# EAGLE design usbasp (EAGLE 6.4)
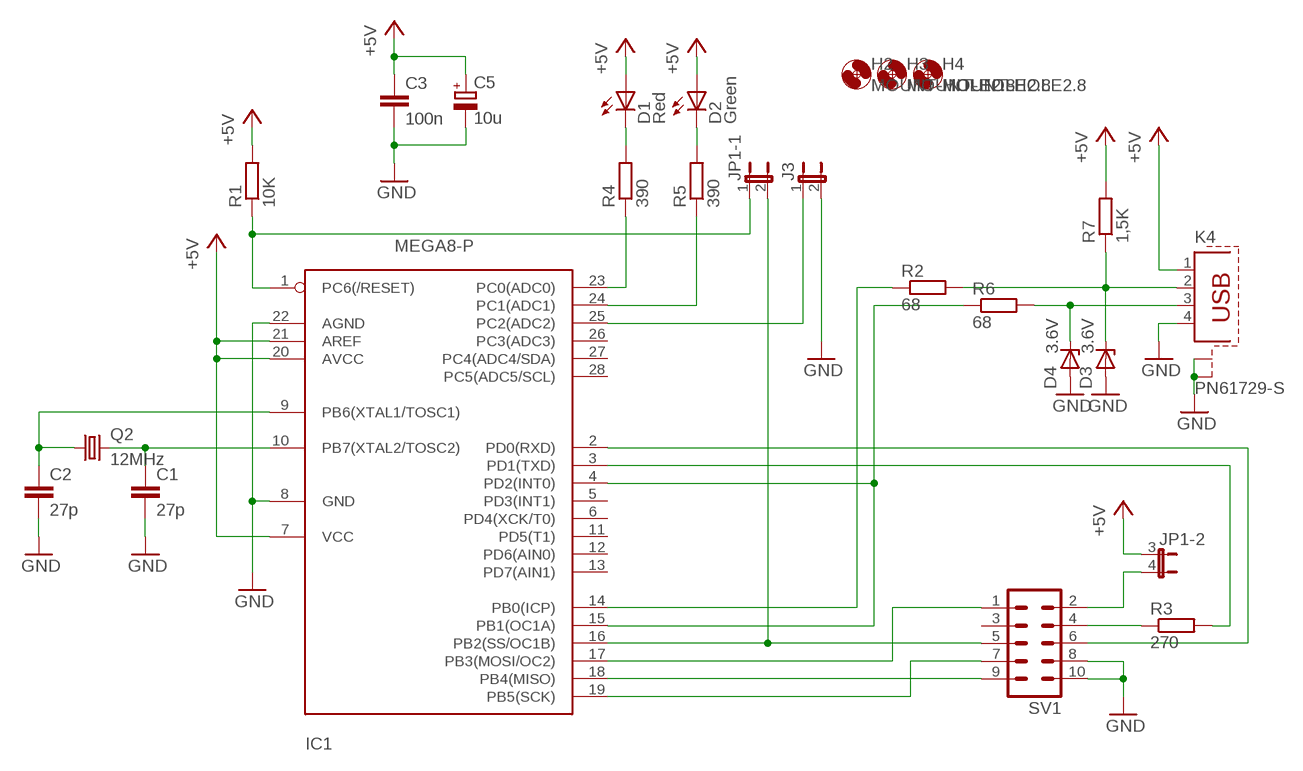
[diagram p0: schematic, sheet 1]

## Parts
C1  27p  C-EU025-024X044  [C025-024X044]
C2  27p  C-EU025-024X044  [C025-024X044]
C3  100n  C5/3  [C5B3]
C5  10u  CPOL-EUE2.5-5  [E2,5-5]
D1  Red  LED5MM  [LED5MM]
D2  Green  LED5MM  [LED5MM]
D3  3.6V  ZENER-DIODEDO34-7  [DO34Z7]
D4  3.6V  ZENER-DIODEDO34-7  [DO34Z7]
H2  MOUNT-HOLE2.8  [2,8]
H3  MOUNT-HOLE2.8  [2,8]
H4  MOUNT-HOLE2.8  [2,8]
IC1  MEGA8-P  [DIL28-3]
J3  JP1E  [JP1]
JP1  JP2QE  [JP2Q]
K4  PN61729-S  [PN61729-S]
Q2  12MHz  CRYSTALHC49S  [HC49/S]
R1  10K  R-EU_0207/10  [0207/10]
R2  68  R-EU_0207/10  [0207/10]
R3  270  R-EU_0207/10  [0207/10]
R4  390  R-EU_0207/10  [0207/10]
R5  390  R-EU_0207/10  [0207/10]
R6  68  R-EU_0207/10  [0207/10]
R7  1,5K  R-EU_0207/10  [0207/10]
SV1  ML10LANG  [ML10_LANG]

## Nets
+5V: C3.1 C5.+ D1.A D2.A IC1.7(VCC) IC1.20(AVCC) IC1.21(AREF) JP1.3 K4.1 R1.2 R7.2
GND: C1.2 C2.2 C3.2 C5.- D3.A D4.A IC1.8(GND) IC1.22(AGND) J3.2 K4.4 K4.S1 K4.S2 SV1.8 SV1.10
N$1: D3.C K4.2 R2.2 R7.1
N$2: D4.C K4.3 R6.2
N$3: C1.1 IC1.10(PB7(XTAL2/TOSC2)) Q2.2
N$4: C2.1 IC1.9(PB6(XTAL1/TOSC1)) Q2.1
N$5: JP1.4 SV1.2
N$6: R3.1 SV1.4
N$7: IC1.3(PD1(TXD)) R3.2
N$8: IC1.2(PD0(RXD)) SV1.6
N$9: IC1.17(PB3(MOSI/OC2)) SV1.1
N$11: IC1.18(PB4(MISO)) SV1.9
N$12: IC1.16(PB2(SS/OC1B)) JP1.2 SV1.5
N$13: IC1.1(PC6(/RESET)) JP1.1 R1.1
N$14: IC1.14(PB0(ICP)) R2.1
N$15: IC1.25(PC2(ADC2)) J3.1
N$16: IC1.23(PC0(ADC0)) R4.1
N$17: IC1.24(PC1(ADC1)) R5.1
N$18: IC1.4(PD2(INT0)) IC1.15(PB1(OC1A)) R6.1
N$19: D1.K(C) R4.2
N$20: D2.K(C) R5.2
N$23: IC1.19(PB5(SCK)) SV1.7
Unconnected: IC1.5(PD3(INT1)) IC1.6(PD4(XCK/T0)) IC1.11(PD5(T1)) IC1.12(PD6(AIN0)) IC1.13(PD7(AIN1)) IC1.26(PC3(ADC3)) IC1.27(PC4(ADC4/SDA)) IC1.28(PC5(ADC5/SCL)) SV1.3

## Library data of the parts
C1 C2 = rcl:C-EU: CAPACITOR, European symbol
C3 = capacitor-wima:C: CAPACITOR naming: grid - package width
C5 = rcl:CPOL-EU: POLARIZED CAPACITOR, European symbol
D1 D2 = tim:LED: LED OSRAM: - CHIPLED LG R971, LG N971, LY N971, LG Q971, LY Q971, LO R971, LY R971 LH N974, LH R974 LS Q976, LO Q976, LY Q976 LO Q996 - Hyper CHIPLED LW Q18S LB Q993, LB Q99A, LB R99A - SideLED LS A670, LO A670, LY A670, LG A670, LP A670 LB A673, LV A673, LT A673, LW A673 LH A674 LY A675 LS A676, LA A676, LO A676, LY A676, LW A676 LS A679, LY A679, LG A679 - Hyper Micro SIDELED® LS Y876, LA Y876, LO Y876, LY Y876 LT Y87S - SmartLED LW L88C, LW L88S LB L89C, LB L89S, LG L890 LS L89K, LO L89K, LY L89K LS L896, LA L896, LO L896, LY L896 - TOPLED LS T670, LO T670, LY T670, LG T670, LP T670 LSG T670, LSP T670, LSY T670, LOP T670, LYG T670 LG T671, LOG T671, LSG T671 LB T673, LV T673, LT T673, LW T673 LH T674 LS T676, LA T676, LO T676, LY T676, LB T676, LH T676, LSB T676, LW T676 LB T67C, LV T67C, LT T67C, LS T67K, LO T67K, LY T67K, LW E67C LS E67B, LA E67B, LO E67B, LY E67B, LB E67C, LV E67C, LT E67C LW T67C LS T679, LY T679, LG T679 LS T770, LO T770, LY T770, LG T770, LP T770 LB T773, LV T773, LT T773, LW T773 LH T774 LS E675, LA E675, LY E675, LS T675 LS T776, LA T776, LO T776, LY T776, LB T776 LHGB T686 LT T68C, LB T68C - Hyper Mini TOPLED® LB M676 - Mini TOPLED Santana® LG M470 LS M47K, LO M47K, LY M47K Source: http://www.osram.convergy.de LUXEON: - LUMILED® LXK2-PW12-R00, LXK2-PW12-S00, LXK2-PW14-U00, LXK2-PW14-V00 LXK2-PM12-R00, LXK2-PM12-S00, LXK2-PM14-U00 LXK2-PE12-Q00, LXK2-PE12-R00, LXK2-PE12-S00, LXK2-PE14-T00, LXK2-PE14-U00 LXK2-PB12-K00, LXK2-PB12-L00, LXK2-PB12-M00, LXK2-PB14-N00, LXK2-PB14-P00, LXK2-PB14-Q00 LXK2-PR12-L00, LXK2-PR12-M00, LXK2-PR14-Q00, LXK2-PR14-R00 LXK2-PD12-Q00, LXK2-PD12-R00, LXK2-PD12-S00 LXK2-PH12-R00, LXK2-PH12-S00 LXK2-PL12-P00, LXK2-PL12-Q00, LXK2-PL12-R00 Source: www.luxeon.com KINGBRIGHT: KA-3528ASYC Source: www.kingbright.com
D3 D4 = diode:ZENER-DIODE: Z-Diode
H2-H4 = holes:MOUNT-HOLE: MOUNTING HOLE with drill center marker
IC1 = tim:MEGA8-P: MICROCONTROLLER 8 Kbytes FLASH 1 kbytes SRAM 512 bytes EEPROM USART 4-channel 10 bit ADC 2-channel 8 bit ADC
J3 = jumper:JP1E: JUMPER
JP1 = jumper:JP2QE: JUMPER
K4 = tim:PN61729-S: BERG USB connector; OC_FARNELL: unknown; OC_NEWARK: unknown
Q2 = tim:CRYSTAL: CRYSTAL; OC_FARNELL: 1667008; OC_NEWARK: unknown
R1-R7 = R:R-EU_: RESISTOR, European symbol
SV1 = conbig:ML10: HARTING

## Board
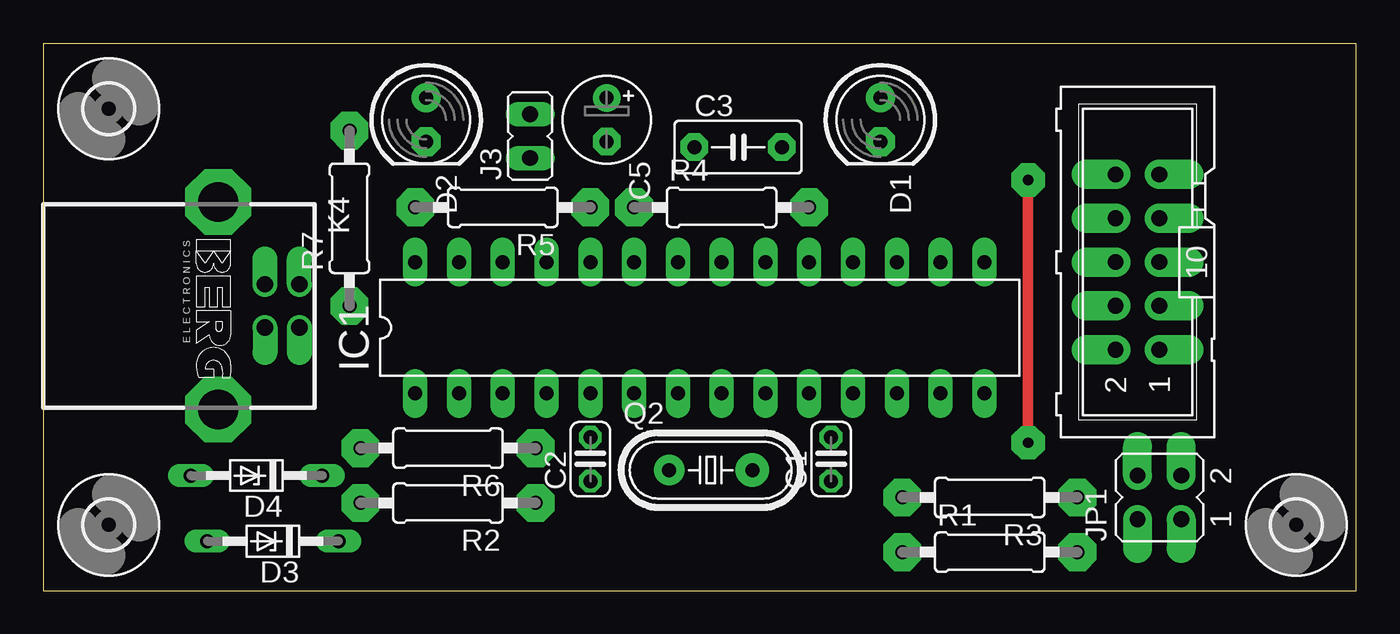
[diagram p1: board, top side]
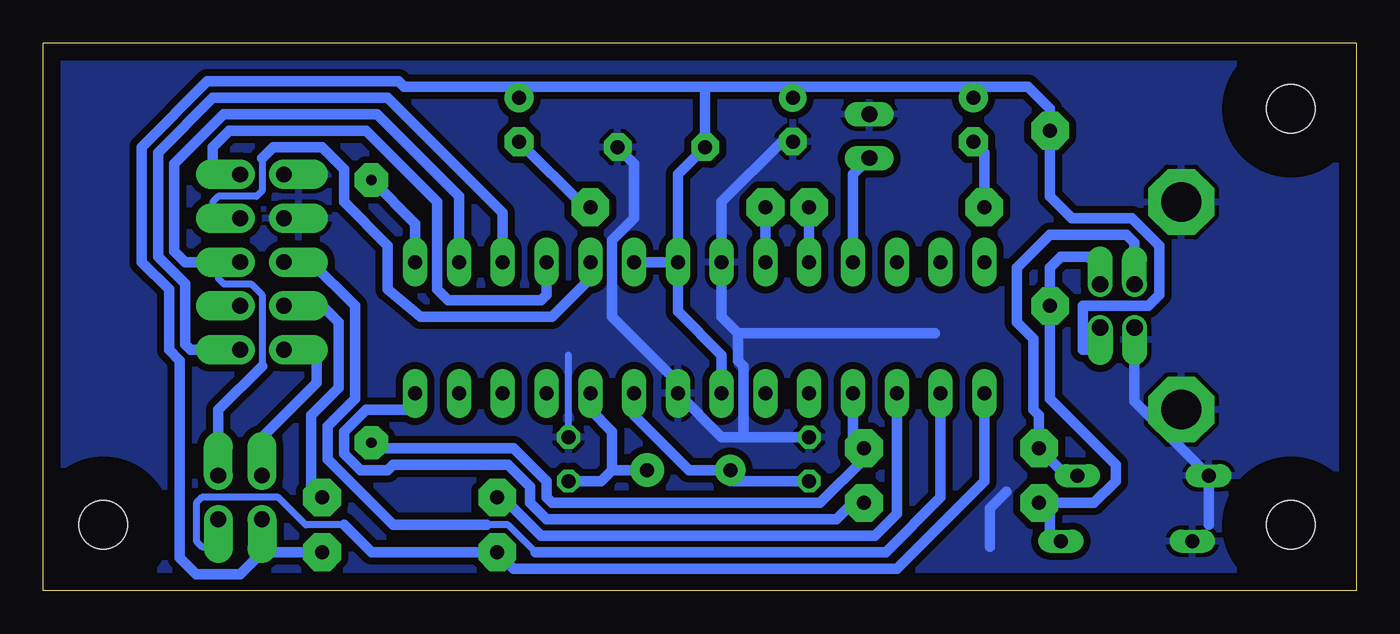
[diagram p2: board, bottom side, seen from below]

Size 76.2 x 31.75 mm. Coordinates in mm from the lower left corner, seen from the top.
Outline: 0,0 76.2,0 76.2,31.75 0,31.75 0,0
Copper layers (1*16): Top 0.035mm / dielectric 1.5mm / Bottom 0.035mm
Design rules "default": minimum track width 10mil, minimum drill 24mil, track to track 8mil, track to pad 8mil, pad to pad 8mil, via to via 8mil, smd to smd 8mil, copper to edge 40mil, drill to drill 8mil, minimum pad ring 10mil, minimum via ring 8mil, stop-mask expansion 4mil, vias tented up to drill 0mil, thermal gap 10mil

### Footprints (pad centres in the part's own frame; a part is rotated, then mirrored left to right if it is on the bottom)
C025-024X044 = drill 0.813 octagon: 1 -1.27,0; 2 1.27,0
C5B3 = drill 0.813 pad 1.6 octagon: 1 -2.54,0; 2 2.54,0
E2,5-5 = drill 0.813 pad 1.6: + -1.27,0 | drill 0.813 pad 1.6 octagon: - 1.27,0
LED5MM = drill 0.813 pad 1.676: A -1.27,0 | drill 0.813 pad 1.676 octagon: K 1.27,0
DO34Z7 = drill 0.813 long: A 3.81,0; C -3.81,0
2,8 = hole 2.8: 0,0
DIL28-3 = drill 0.813 pad 1.422 long: 1 -16.51,-3.81; 2 -13.97,-3.81; 3 -11.43,-3.81; 4 -8.89,-3.81; 5 -6.35,-3.81; 6 -3.81,-3.81; 7 -1.27,-3.81; 8 1.27,-3.81; 9 3.81,-3.81; 10 6.35,-3.81; 11 8.89,-3.81; 12 11.43,-3.81; 13 13.97,-3.81; 14 16.51,-3.81; 15 16.51,3.81; 16 13.97,3.81; 17 11.43,3.81; 18 8.89,3.81; 19 6.35,3.81; 20 3.81,3.81; 21 1.27,3.81; 22 -1.27,3.81; 23 -3.81,3.81; 24 -6.35,3.81; 25 -8.89,3.81; 26 -11.43,3.81; 27 -13.97,3.81; 28 -16.51,3.81
JP1 = drill 0.914 long: 1 0,-1.27; 2 0,1.27
JP2Q = drill 0.914 pad 1.676 offset: 1 -1.27,-1.27; 2 1.27,-1.27; 3 -1.27,1.27; 4 1.27,1.27
PN61729-S = drill 0.95 pad 1.422 offset: 1 1.25,4.71; 2 -1.25,4.71; 3 -1.25,2.71; 4 1.25,2.71 | drill 2.3 pad 3.81 octagon: S1 -6.02,0; S2 6.02,0
HC49/S = drill 0.813 pad 1.778: 1 -2.413,0 | drill 0.813 pad 1.93: 2 2.413,0
0207/10 = drill 0.813 pad 2.184 octagon: 1 -5.08,0; 2 5.08,0
ML10_LANG = drill 0.914 pad 1.7 offset: 1 -5.08,-1.27; 2 -5.08,1.27; 3 -2.54,-1.27; 4 -2.54,1.27; 5 0,-1.27; 6 0,1.27; 7 2.54,-1.27; 8 2.54,1.27; 9 5.08,-1.27; 10 5.08,1.27

### Placement (x,y rotation side)
C1  45.72,7.62 90 top
C2  31.75,7.62 90 top
C3  40.32,25.72 0 top
C5  32.7,27.3 270 top
D1  48.58,27.3 270 top
D2  22.23,27.3 270 top
D3  13.34,2.86 180 top
D4  12.38,6.67 180 top
H2  72.71,3.81 0 top
H3  3.81,3.81 0 top
H4  3.81,27.94 0 top
IC1  38.1,15.24 0 top
J3  28.26,26.35 0 top
JP1  64.77,5.4 90 top
K4  10.16,16.51 270 top
Q2  38.73,6.99 0 top
R1  54.93,2.22 0 top
R2  23.5,5.08 180 top
R3  54.93,5.4 180 top
R4  39.37,22.23 0 top
R5  26.67,22.23 180 top
R6  23.5,8.26 180 top
R7  17.78,21.59 90 top
SV1  63.5,19.05 90 top

### Tracks (layer width: path | path; a pad name or v marks a point on that pad's centre or on a via)
+5V
  Bottom 0.61: JP1.3 63.5,2.54 | 63.5,2.54 63.5,1.91 63.82,1.91 64.77,0.95 67.31,0.95 68.26,1.91 68.26,13.34 68.9,13.97 68.9,17.46 70.48,19.05 70.48,25.72 66.67,29.53 55.56,29.53 55.24,29.21 48.58,29.21 | IC1.21 39.37,24.13 C3.1 37.78,29.21 | IC1.20 IC1.21 | IC1.7 36.83,13.65 39.37,16.19 IC1.21 | 21.91,29.21 19.05,29.21 17.78,27.94 R7.2 17.78,22.86 16.51,21.59 13.02,21.59 11.43,20 11.43,17.14 12.06,16.51 15.88,16.51 15.88,13.97 15.24,13.97 14.92,14.29 14.92,15.21 K4.1 | 21.91,29.21 32.7,29.21 | 32.7,29.21 37.78,29.21 | 37.78,29.21 48.58,29.21 | D2.A 22.23,28.89 21.91,29.21 | D1.A 48.58,29.21 | C5.+ 32.7,29.21 | R1.2 63.18,2.22 arc90 63.5,2.54
GND
  Bottom 0.406: C1.2 45.72,13.65
  Bottom 0.61: C2.2 35.56,8.89 | 35.56,8.89 36.83,8.89 IC1.8 39.37,12.06 43.18,15.88 43.18,20.32 41.91,21.59 41.91,24.77 C3.2 | 8.57,3.81 D4.A 12.87,10.96 K4.4 | 21.27,2.54 21.27,4.76 20.32,5.71 | 24.45,14.92 35.88,14.92 | 35.88,14.92 36.83,15.88 IC1.22 36.83,22.54 33.34,26.04 C5.- | 35.88,14.92 35.88,13.34 35.56,13.02 35.56,8.89
  pour Bottom (rank 3, no thermals): 69.85,17.14 76.2,17.46 76.2,7.94 69.53,7.94
  pour Bottom (rank 3, no thermals): 1.27,23.18 7.94,23.18 7.94,7.94 1.27,7.94
  pour Bottom (isolate 0.406, rank 4): 0,0 76.2,0 76.2,31.75 0,31.75
  pour Bottom (rank 3, no thermals): 20.64,16.19 22.86,16.19 22.86,13.34 20.64,13.34
N$1
  Bottom 0.61: 17.78,5.08 15.24,5.08 13.97,6.35 13.97,7.3 17.78,11.11 R7.1 17.78,18.73 17.14,19.37 15.56,19.37 14.87,18.68 K4.2 | 17.78,5.08 R2.2 | D3.C 17.78,2.86 17.78,5.08
N$2
  Bottom 0.61: D4.C 16.83,6.67 R6.2 18.41,10.16 18.73,10.48 18.73,14.61 19.68,15.56 19.68,18.73 17.78,20.64 13.34,20.64 12.87,20.17 K4.3
N$3
  Bottom 0.61: IC1.10 44.45,10.48 43.18,9.21 43.18,6.99 | 43.18,6.99 Q2.2 | C1.1 43.81,6.35 43.18,6.99
N$4
  Bottom 0.61: C2.1 36.32,6.35 Q2.1 38.73,6.99 41.91,10.16 IC1.9
N$5
  Bottom 0.61: JP1.4 63.5,8.89 60.33,12.06 60.33,13.34 60.96,13.97 SV1.2
N$6
  Bottom 0.61: R3.1 60.64,6.03 60.64,10.16 59.05,11.75 59.05,15.56 60.01,16.51 SV1.4
N$7
  Bottom 0.61: IC1.3 26.67,4.45 27.94,3.17 47.31,3.17 49.53,5.4 R3.2
N$8
  Bottom 0.406: 47.62,2.22 49.21,3.81 50.48,3.81
  Bottom 0.61: IC1.2 24.13,5.4 27.3,2.22 47.62,2.22 | SV1.6 60.64,19.05 58.1,16.51 58.1,11.11 59.69,9.53 59.69,7.62 55.88,3.81 50.48,3.81
N$9
  Bottom 0.61: IC1.17 49.53,21.91 56.2,28.57 57.15,28.57 57.47,28.57 66.36,28.57 69.53,25.4 69.53,19.37 67.94,17.78 67.94,14.29 67.63,13.97 SV1.1
N$11
  Bottom 0.61: IC1.18 46.99,17.14 47.31,16.83 52.7,16.83 53.34,17.46 53.34,22.54 57.47,26.67 65.41,26.67 66.36,25.72 66.36,24.77 65.72,24.13 SV1.9
N$12
  Bottom 0.406: 66.04,19.05 66.04,18.1 65.72,17.78 64.14,17.78 63.5,17.14 63.5,13.02
  Bottom 0.61: SV1.5 66.04,19.05 67.94,19.05 68.58,19.68 68.58,24.77 65.72,27.62 58.1,27.62 57.47,27.62 56.83,27.62 52.07,22.86 IC1.16 | 63.5,13.02 66.04,10.48 JP1.2
N$13
  Bottom 0.406: 58.74,3.81 60.96,3.81 62.55,5.4 66.99,5.4 67.31,5.08 67.31,2.86 66.99,2.54 66.04,2.54 JP1.1
  Bottom 0.61: 58.74,3.81 57.15,2.22 R1.1 48.9,1.27 26.67,1.27 21.59,6.35 IC1.1
N$14
  Bottom 0.61: R2.1 29.21,5.08 30.16,4.13 46.99,4.13 47.94,5.08 47.94,6.03 49.21,7.3 55.88,7.3 56.2,6.99 57.78,6.99 58.74,7.94 58.74,9.21 57.47,10.48 54.93,10.48 54.61,10.79 IC1.14
N$15
  Bottom 0.61: IC1.25 29.21,24.13 J3.1
N$16
  Bottom 0.61: IC1.23 R4.1
N$17
  Bottom 0.61: IC1.24 R5.1
N$18  (via drill 0.6 pad 1.93)
  Top 0.61: v57.15,23.81 v57.15,8.57
  Bottom 0.61: IC1.4 29.21,8.89 R6.1 28.57,7.62 31.11,5.08 46.67,5.08 46.99,5.4 46.99,6.35 48.9,8.26 56.83,8.26 v57.15,8.57 | IC1.15 54.61,21.27 v57.15,23.81
N$19
  Bottom 0.61: R4.2 44.77,22.23 D1.K
N$20
  Bottom 0.61: R5.2 21.59,25.4 D2.K
N$23
  Bottom 0.406: 63.5,25.08 63.5,23.18 63.82,22.86 66.04,22.86 66.36,22.54 66.36,21.59 SV1.7
  Bottom 0.61: IC1.19 44.45,18.1 46.67,15.88 54.29,15.88 56.2,17.46 56.2,20 58.74,22.54 58.74,24.45 60.01,25.72 62.87,25.72 63.5,25.08

### Text on the board
bRestrict: + | das-labor | trgt pwr | slf prg